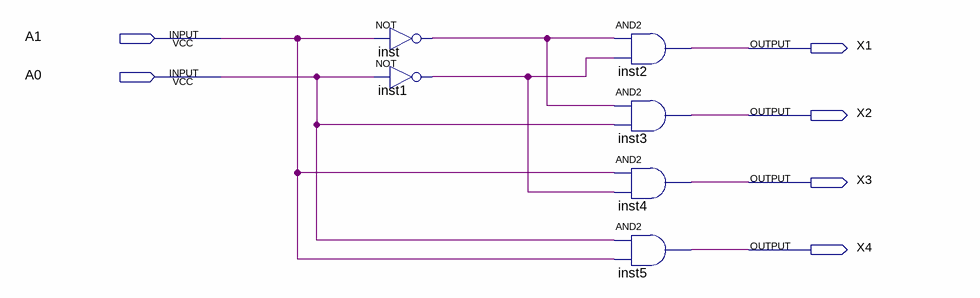
[diagram p0: schematic sheet]
// Quartus schematic 24decoder.bdf as structural Verilog: 6 symbols, 6 pins
module \24decoder  (
  input  A1,
  input  A0,
  output X1,
  output X2,
  output X3,
  output X4
);

  wire inst1_out, inst_out;

  not inst (inst_out, A1);
  not inst1 (inst1_out, A0);
  and inst2 (X1, inst_out, inst1_out);
  and inst3 (X2, inst_out, A0);
  and inst4 (X3, A1, inst1_out);
  and inst5 (X4, A0, A1);
endmodule
